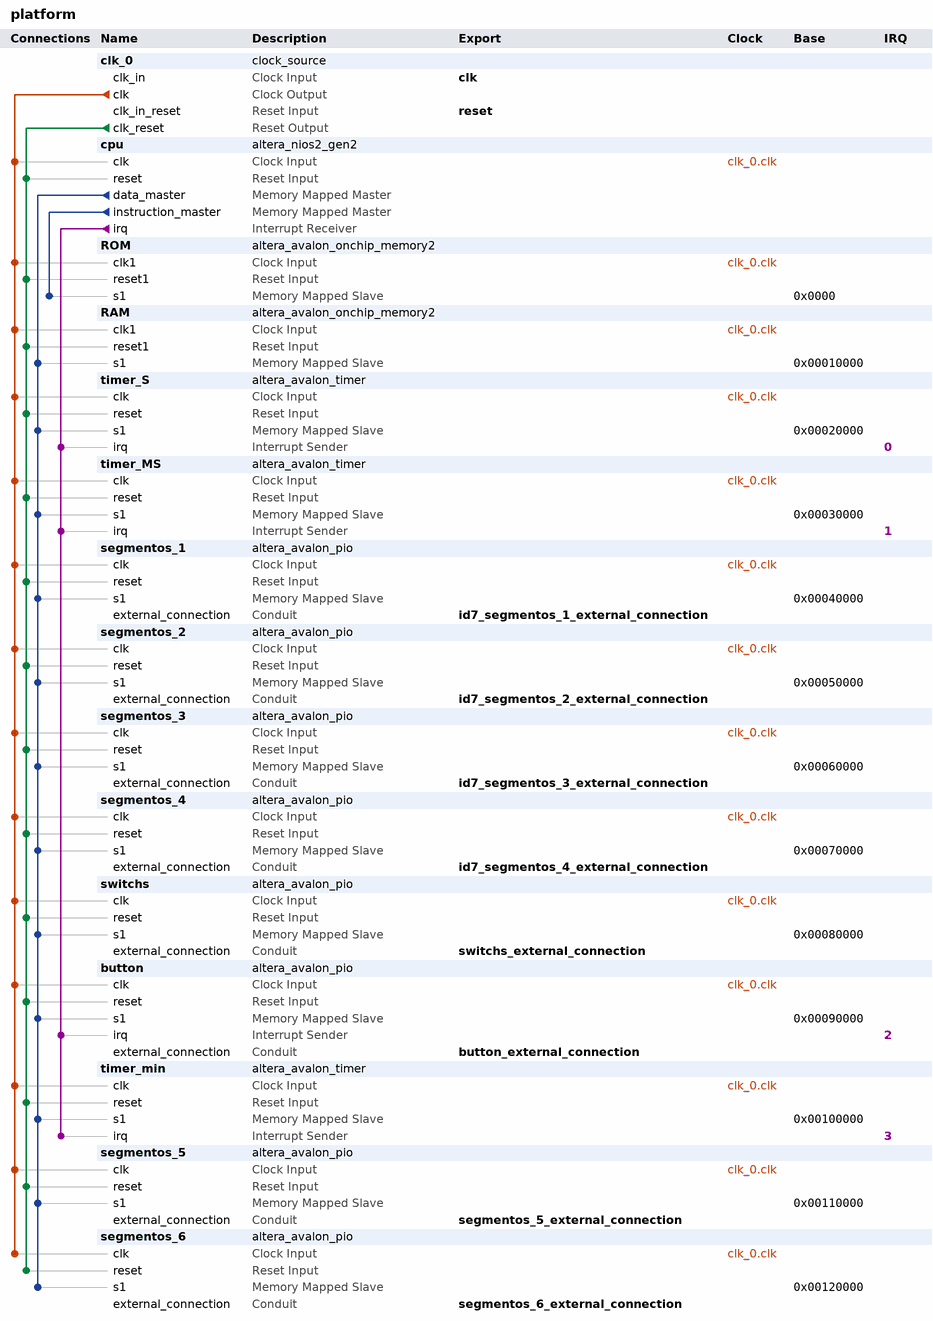
[diagram p0: system contents]
# Platform Designer (Qsys) system platform, Cyclone V 5CSEMA5F31C6
# Parameters at their usual value, and those the tool derives, are not listed.
package require -exact qsys 20.1
create_system platform
set_project_property DEVICE_FAMILY {Cyclone V}
set_project_property DEVICE 5CSEMA5F31C6

add_instance clk_0 clock_source 20.1
set_instance_parameter_value clk_0 clockFrequency 50000000

add_instance cpu altera_nios2_gen2 20.1
set_instance_parameter_value cpu dcache_size 2048
set_instance_parameter_value cpu debug_enabled false
set_instance_parameter_value cpu exceptionSlave ROM.s1
set_instance_parameter_value cpu icache_size 4096
set_instance_parameter_value cpu impl Tiny
set_instance_parameter_value cpu resetSlave ROM.s1

add_instance ROM altera_avalon_onchip_memory2 20.1
set_instance_parameter_value ROM dataWidth 32
set_instance_parameter_value ROM dualPort false
set_instance_parameter_value ROM initMemContent true
set_instance_parameter_value ROM initializationFileName onchip_mem.hex
set_instance_parameter_value ROM memorySize 4096
set_instance_parameter_value ROM writable false

add_instance RAM altera_avalon_onchip_memory2 20.1
set_instance_parameter_value RAM dataWidth 32
set_instance_parameter_value RAM dualPort false
set_instance_parameter_value RAM initMemContent true
set_instance_parameter_value RAM initializationFileName onchip_mem.hex
set_instance_parameter_value RAM memorySize 4096

add_instance timer_S altera_avalon_timer 20.1
set_instance_parameter_value timer_S alwaysRun true
set_instance_parameter_value timer_S fixedPeriod true
set_instance_parameter_value timer_S period 1
set_instance_parameter_value timer_S periodUnits SEC
set_instance_parameter_value timer_S snapshot false

add_instance timer_MS altera_avalon_timer 20.1
set_instance_parameter_value timer_MS alwaysRun true
set_instance_parameter_value timer_MS fixedPeriod true
set_instance_parameter_value timer_MS period 1
set_instance_parameter_value timer_MS periodUnits MSEC
set_instance_parameter_value timer_MS snapshot false

add_instance segmentos_1 altera_avalon_pio 20.1
set_instance_parameter_value segmentos_1 direction Output
set_instance_parameter_value segmentos_1 width 7

add_instance segmentos_2 altera_avalon_pio 20.1
set_instance_parameter_value segmentos_2 direction Output
set_instance_parameter_value segmentos_2 width 7

add_instance segmentos_3 altera_avalon_pio 20.1
set_instance_parameter_value segmentos_3 direction Output
set_instance_parameter_value segmentos_3 width 7

add_instance segmentos_4 altera_avalon_pio 20.1
set_instance_parameter_value segmentos_4 direction Output
set_instance_parameter_value segmentos_4 width 7

add_instance switchs altera_avalon_pio 20.1
set_instance_parameter_value switchs direction Input
set_instance_parameter_value switchs width 2

add_instance button altera_avalon_pio 20.1
set_instance_parameter_value button captureEdge true
set_instance_parameter_value button direction Input
set_instance_parameter_value button edgeType FALLING
set_instance_parameter_value button generateIRQ true
set_instance_parameter_value button width 1

add_instance timer_min altera_avalon_timer 20.1
set_instance_parameter_value timer_min alwaysRun true
set_instance_parameter_value timer_min fixedPeriod true
set_instance_parameter_value timer_min period 60
set_instance_parameter_value timer_min periodUnits SEC
set_instance_parameter_value timer_min snapshot false

add_instance segmentos_5 altera_avalon_pio 20.1
set_instance_parameter_value segmentos_5 direction Output
set_instance_parameter_value segmentos_5 width 7

add_instance segmentos_6 altera_avalon_pio 20.1
set_instance_parameter_value segmentos_6 direction Output
set_instance_parameter_value segmentos_6 width 7

# connections
add_connection clk_0.clk button.clk clock
add_connection clk_0.clk cpu.clk clock
add_connection clk_0.clk RAM.clk1 clock
add_connection clk_0.clk ROM.clk1 clock
add_connection clk_0.clk segmentos_1.clk clock
add_connection clk_0.clk segmentos_2.clk clock
add_connection clk_0.clk segmentos_3.clk clock
add_connection clk_0.clk segmentos_4.clk clock
add_connection clk_0.clk segmentos_5.clk clock
add_connection clk_0.clk segmentos_6.clk clock
add_connection clk_0.clk switchs.clk clock
add_connection clk_0.clk timer_min.clk clock
add_connection clk_0.clk timer_MS.clk clock
add_connection clk_0.clk timer_S.clk clock
add_connection clk_0.clk_reset button.reset reset
add_connection clk_0.clk_reset cpu.reset reset
add_connection clk_0.clk_reset RAM.reset1 reset
add_connection clk_0.clk_reset ROM.reset1 reset
add_connection clk_0.clk_reset segmentos_1.reset reset
add_connection clk_0.clk_reset segmentos_2.reset reset
add_connection clk_0.clk_reset segmentos_3.reset reset
add_connection clk_0.clk_reset segmentos_4.reset reset
add_connection clk_0.clk_reset segmentos_5.reset reset
add_connection clk_0.clk_reset segmentos_6.reset reset
add_connection clk_0.clk_reset switchs.reset reset
add_connection clk_0.clk_reset timer_min.reset reset
add_connection clk_0.clk_reset timer_MS.reset reset
add_connection clk_0.clk_reset timer_S.reset reset
add_connection cpu.data_master button.s1 avalon
set_connection_parameter_value cpu.data_master/button.s1 baseAddress 0x00090000
add_connection cpu.data_master RAM.s1 avalon
set_connection_parameter_value cpu.data_master/RAM.s1 baseAddress 0x00010000
add_connection cpu.data_master segmentos_1.s1 avalon
set_connection_parameter_value cpu.data_master/segmentos_1.s1 baseAddress 0x00040000
add_connection cpu.data_master segmentos_2.s1 avalon
set_connection_parameter_value cpu.data_master/segmentos_2.s1 baseAddress 0x00050000
add_connection cpu.data_master segmentos_3.s1 avalon
set_connection_parameter_value cpu.data_master/segmentos_3.s1 baseAddress 0x00060000
add_connection cpu.data_master segmentos_4.s1 avalon
set_connection_parameter_value cpu.data_master/segmentos_4.s1 baseAddress 0x00070000
add_connection cpu.data_master segmentos_5.s1 avalon
set_connection_parameter_value cpu.data_master/segmentos_5.s1 baseAddress 0x00110000
add_connection cpu.data_master segmentos_6.s1 avalon
set_connection_parameter_value cpu.data_master/segmentos_6.s1 baseAddress 0x00120000
add_connection cpu.data_master switchs.s1 avalon
set_connection_parameter_value cpu.data_master/switchs.s1 baseAddress 0x00080000
add_connection cpu.data_master timer_min.s1 avalon
set_connection_parameter_value cpu.data_master/timer_min.s1 baseAddress 0x00100000
add_connection cpu.data_master timer_MS.s1 avalon
set_connection_parameter_value cpu.data_master/timer_MS.s1 baseAddress 0x00030000
add_connection cpu.data_master timer_S.s1 avalon
set_connection_parameter_value cpu.data_master/timer_S.s1 baseAddress 0x00020000
add_connection cpu.instruction_master ROM.s1 avalon
set_connection_parameter_value cpu.instruction_master/ROM.s1 baseAddress 0x0000
add_connection cpu.irq button.irq interrupt
set_connection_parameter_value cpu.irq/button.irq irqNumber 2
add_connection cpu.irq timer_min.irq interrupt
set_connection_parameter_value cpu.irq/timer_min.irq irqNumber 3
add_connection cpu.irq timer_MS.irq interrupt
set_connection_parameter_value cpu.irq/timer_MS.irq irqNumber 1
add_connection cpu.irq timer_S.irq interrupt
set_connection_parameter_value cpu.irq/timer_S.irq irqNumber 0

# exported interfaces
add_interface button_external_connection conduit end
set_interface_property button_external_connection EXPORT_OF button.external_connection
add_interface clk clock sink
set_interface_property clk EXPORT_OF clk_0.clk_in
add_interface id7_segmentos_1_external_connection conduit end
set_interface_property id7_segmentos_1_external_connection EXPORT_OF segmentos_1.external_connection
add_interface id7_segmentos_2_external_connection conduit end
set_interface_property id7_segmentos_2_external_connection EXPORT_OF segmentos_2.external_connection
add_interface id7_segmentos_3_external_connection conduit end
set_interface_property id7_segmentos_3_external_connection EXPORT_OF segmentos_3.external_connection
add_interface id7_segmentos_4_external_connection conduit end
set_interface_property id7_segmentos_4_external_connection EXPORT_OF segmentos_4.external_connection
add_interface reset reset sink
set_interface_property reset EXPORT_OF clk_0.clk_in_reset
add_interface segmentos_5_external_connection conduit end
set_interface_property segmentos_5_external_connection EXPORT_OF segmentos_5.external_connection
add_interface segmentos_6_external_connection conduit end
set_interface_property segmentos_6_external_connection EXPORT_OF segmentos_6.external_connection
add_interface switchs_external_connection conduit end
set_interface_property switchs_external_connection EXPORT_OF switchs.external_connection

set_interconnect_requirement {$system} qsys_mm.clockCrossingAdapter HANDSHAKE
set_interconnect_requirement {$system} qsys_mm.enableEccProtection FALSE
set_interconnect_requirement {$system} qsys_mm.insertDefaultSlave FALSE
set_interconnect_requirement {$system} qsys_mm.maxAdditionalLatency 1

save_system platform.qsys
